# Altium schematic sheet FMC_ADC_128CH_10B.schdoc: FMC ADC 128CH 10B
size 420 x 297 mm; EDA_Number: ARTIQ; Projet: ARTIQ/SINARA; Author: G.Kasprowicz; CompanyName: WUT ISE; DrawnBy: G.Kasprowicz; Organization: WUT ISE; Address1: PW ISE; Address2: Nowowiejska 15/19 00-665 Warsaw; Address3: gkasprow@gmail.com; DocumentNumber: 6; Revision: 1.1; SheetNumber: 6; SheetTotal: 9; ModifiedBy: F. Świtakowski; CheckedDate: -; Title2: Top; DivGrp: WUT ISE; Designer: G.Kasprowicz; ModifiedDate: -; ProjectName: Sensor Box
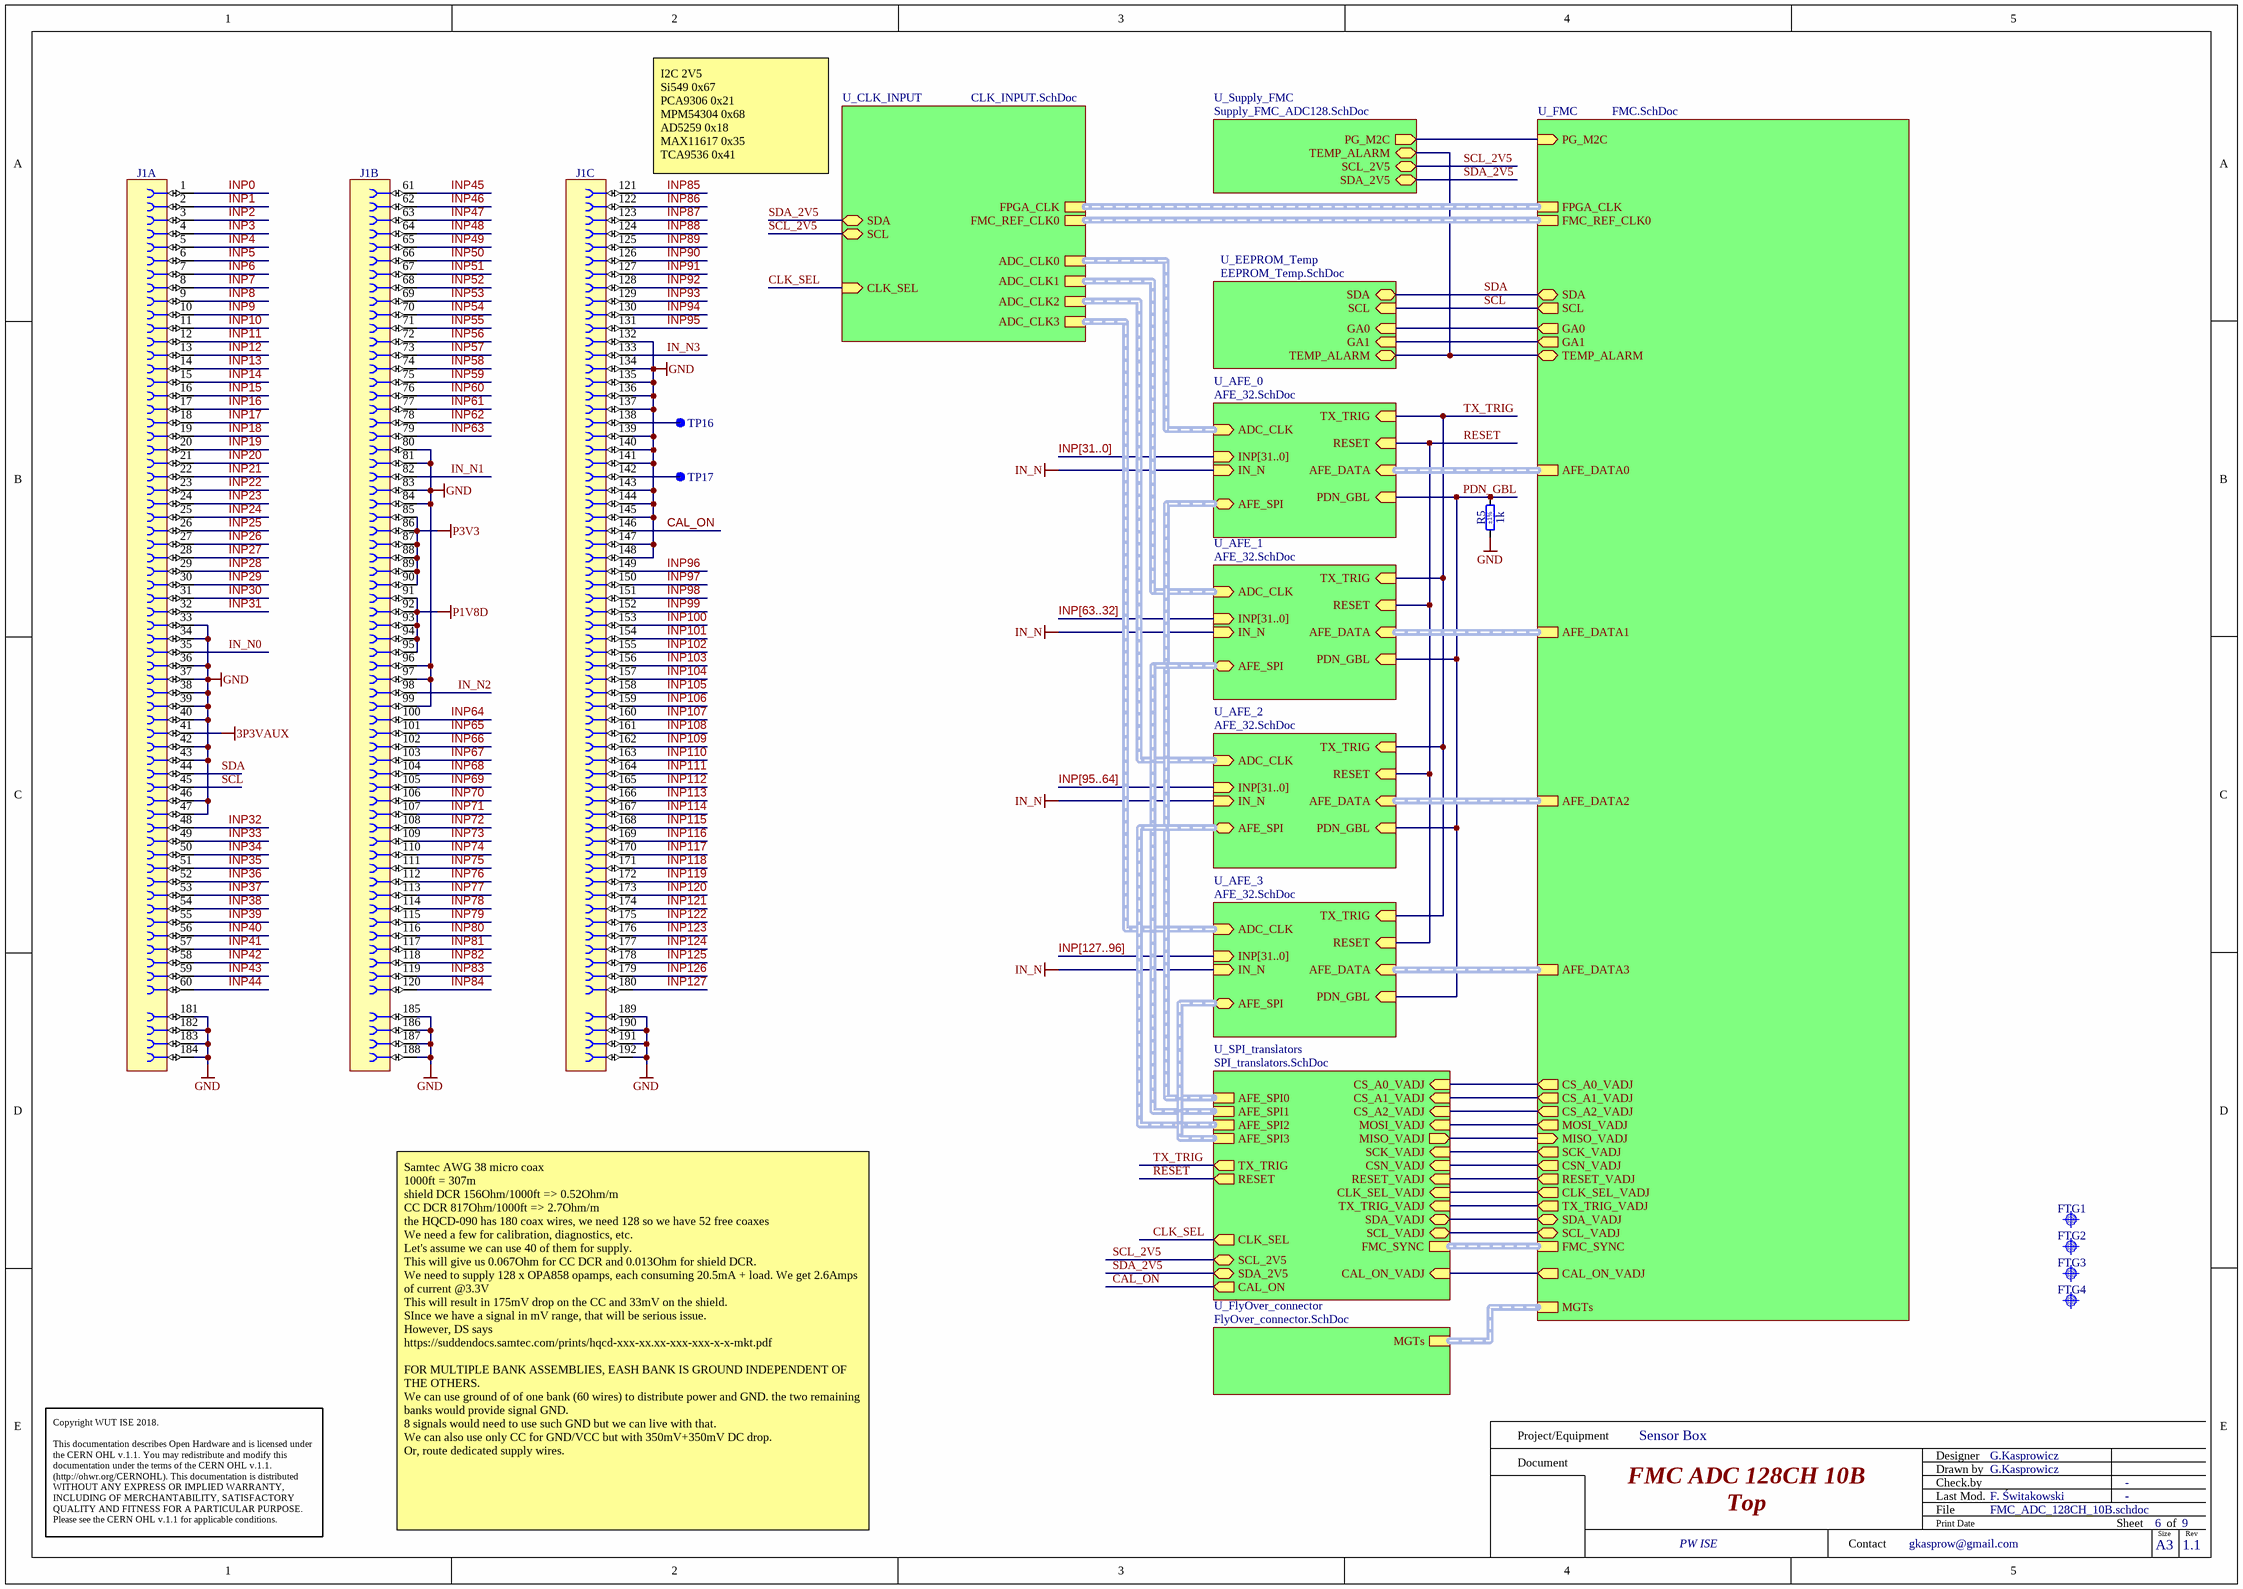
[diagram p0: FMC_ADC_128CH_10B.schdoc]

## Parts
FTG1  Use only in PCB  [FIDUCIAL_TOP_C100-200]  (value not drawn)  (no BOM)
FTG2  Use only in PCB  [FIDUCIAL_TOP_S100-200]  (value not drawn)  (no BOM)
FTG3  Use only in PCB  [FIDUCIAL_TOP_C100-200]  (value not drawn)  (no BOM)
FTG4  Use only in PCB  [FIDUCIAL_TOP_S100-200]  (value not drawn)  (no BOM)
J1  (no value)  [SAMTEC_QSH-090-01-L-D-A]  (parts A,B,C of 3)
R5  1k  Tolerance: ±1%  [RESC1005X40N]
TP16  SMD Pad  [C100]  (value not drawn)
TP17  SMD Pad  [C100]  (value not drawn)

## Sub-sheets
U_AFE_0 = AFE_32.SchDoc: PDN_GBL (in), ADC_CLK (in, harness DIFF), INP[31..0] (in), AFE_DATA (in, harness AFE_DATA), RESET (in), AFE_SPI (bidir, harness AFE_SPI), TX_TRIG (in), IN_N (in)
U_AFE_1 = AFE_32.SchDoc: PDN_GBL (in), ADC_CLK (in, harness DIFF), INP[31..0] (in), AFE_DATA (in, harness AFE_DATA), RESET (in), AFE_SPI (bidir, harness AFE_SPI), TX_TRIG (in), IN_N (in)
U_AFE_2 = AFE_32.SchDoc: PDN_GBL (in), ADC_CLK (in, harness DIFF), INP[31..0] (in), AFE_DATA (in, harness AFE_DATA), RESET (in), AFE_SPI (bidir, harness AFE_SPI), TX_TRIG (in), IN_N (in)
U_AFE_3 = AFE_32.SchDoc: PDN_GBL (in), ADC_CLK (in, harness DIFF), INP[31..0] (in), AFE_DATA (in, harness AFE_DATA), RESET (in), AFE_SPI (bidir, harness AFE_SPI), TX_TRIG (in), IN_N (in)
U_CLK_INPUT = CLK_INPUT.SchDoc: ADC_CLK0 (harness DIFFCLK), ADC_CLK1 (harness DIFFCLK), ADC_CLK2 (harness DIFFCLK), ADC_CLK3 (harness DIFFCLK), FMC_REF_CLK0 (harness DIFFCLK), FPGA_CLK (harness DIFFCLK), SCL (bidir), CLK_SEL (in), SDA (bidir)
U_EEPROM_Temp = EEPROM_Temp.SchDoc: SDA (bidir), SCL (in), GA0 (in), GA1 (in), TEMP_ALARM (bidir)
U_FlyOver_connector = FlyOver_connector.SchDoc: MGTs (harness MGTs)
U_FMC = FMC.SchDoc: GA0 (out), GA1 (out), SDA (bidir), SCL (out), TEMP_ALARM (bidir), FPGA_CLK (harness DIFF), PG_M2C (in), FMC_SYNC (harness DIFF), FMC_REF_CLK0 (harness DIFF), AFE_DATA0 (harness AFE_DATA), AFE_DATA1 (harness AFE_DATA), AFE_DATA2 (harness AFE_DATA), AFE_DATA3 (harness AFE_DATA), CS_A0_VADJ (out), CS_A1_VADJ (out), CS_A2_VADJ (out), MOSI_VADJ (out), MISO_VADJ (in), SCK_VADJ (out), RESET_VADJ (out), TX_TRIG_VADJ (out), SDA_VADJ (bidir), SCL_VADJ (bidir), CSN_VADJ (out), CLK_SEL_VADJ (out), CAL_ON_VADJ (out), MGTs (harness MGTs)
U_SPI_translators = SPI_translators.SchDoc: AFE_SPI0 (harness AFE_SPI), AFE_SPI1 (harness AFE_SPI), AFE_SPI2 (harness AFE_SPI), AFE_SPI3 (harness AFE_SPI), TX_TRIG (out), RESET (out), MOSI_VADJ (in), SCK_VADJ (in), RESET_VADJ (in), CS_A0_VADJ (in), CS_A1_VADJ (in), MISO_VADJ (out), CS_A2_VADJ (in), TX_TRIG_VADJ (in), CSN_VADJ (in), SCL_VADJ (bidir), SDA_VADJ (bidir), CLK_SEL (out), CLK_SEL_VADJ (in), FMC_SYNC (harness DIFF), CAL_ON_VADJ (in), SCL_2V5 (bidir), SDA_2V5 (bidir), CAL_ON (out)
U_Supply_FMC = Supply_FMC_ADC128.SchDoc: PG_M2C (out), TEMP_ALARM (bidir), SCL_2V5 (bidir), SDA_2V5 (bidir)

## Nets
3P3VAUX: J1.41
GND: J1.33 J1.34 J1.36 J1.37 J1.38 J1.39 J1.40 J1.42 J1.43 J1.46 J1.47 J1.80 J1.81 J1.83 J1.84 J1.96 J1.97 J1.99 J1.132 J1.134 J1.135 J1.136 J1.137 J1.139 J1.140 J1.141 J1.143 J1.144 J1.145 J1.147 J1.148 J1.181 J1.182 J1.183 J1.184 J1.185 J1.186 J1.187 J1.188 J1.189 J1.190 J1.191 J1.192 R5.1
IN_N: sheet U_AFE_0/IN_N, sheet U_AFE_1/IN_N, sheet U_AFE_2/IN_N, sheet U_AFE_3/IN_N
P1V8D: J1.91 J1.92 J1.93 J1.94 J1.95
P3V3: J1.85 J1.86 J1.87 J1.88 J1.89 J1.90
CAL_ON: J1.146 ; sheet U_SPI_translators/CAL_ON
CLK_SEL: sheet U_CLK_INPUT/CLK_SEL, sheet U_SPI_translators/CLK_SEL
IN_N0: J1.35
IN_N1: J1.82
IN_N2: J1.98
IN_N3: J1.133
INP0: J1.1
INP1: J1.2
INP2: J1.3
INP3: J1.4
INP4: J1.5
INP5: J1.6
INP6: J1.7
INP7: J1.8
INP8: J1.9
INP9: J1.10
INP10: J1.11
INP11: J1.12
INP12: J1.13
INP13: J1.14
INP14: J1.15
INP15: J1.16
INP16: J1.17
INP17: J1.18
INP18: J1.19
INP19: J1.20
INP20: J1.21
INP21: J1.22
INP22: J1.23
INP23: J1.24
INP24: J1.25
INP25: J1.26
INP26: J1.27
INP27: J1.28
INP28: J1.29
INP29: J1.30
INP30: J1.31
INP31: J1.32
INP32: J1.48
INP33: J1.49
INP34: J1.50
INP35: J1.51
INP36: J1.52
INP37: J1.53
INP38: J1.54
INP39: J1.55
INP40: J1.56
INP41: J1.57
INP42: J1.58
INP43: J1.59
INP44: J1.60
INP45: J1.61
INP46: J1.62
INP47: J1.63
INP48: J1.64
INP49: J1.65
INP50: J1.66
INP51: J1.67
INP52: J1.68
INP53: J1.69
INP54: J1.70
INP55: J1.71
INP56: J1.72
INP57: J1.73
INP58: J1.74
INP59: J1.75
INP60: J1.76
INP61: J1.77
INP62: J1.78
INP63: J1.79
INP64: J1.100
INP65: J1.101
INP66: J1.102
INP67: J1.103
INP68: J1.104
INP69: J1.105
INP70: J1.106
INP71: J1.107
INP72: J1.108
INP73: J1.109
INP74: J1.110
INP75: J1.111
INP76: J1.112
INP77: J1.113
INP78: J1.114
INP79: J1.115
INP80: J1.116
INP81: J1.117
INP82: J1.118
INP83: J1.119
INP84: J1.120
INP85: J1.121
INP86: J1.122
INP87: J1.123
INP88: J1.124
INP89: J1.125
INP90: J1.126
INP91: J1.127
INP92: J1.128
INP93: J1.129
INP94: J1.130
INP95: J1.131
INP96: J1.149
INP97: J1.150
INP98: J1.151
INP99: J1.152
INP100: J1.153
INP101: J1.154
INP102: J1.155
INP103: J1.156
INP104: J1.157
INP105: J1.158
INP106: J1.159
INP107: J1.160
INP108: J1.161
INP109: J1.162
INP110: J1.163
INP111: J1.164
INP112: J1.165
INP113: J1.166
INP114: J1.167
INP115: J1.168
INP116: J1.169
INP117: J1.170
INP118: J1.171
INP119: J1.172
INP120: J1.173
INP121: J1.174
INP122: J1.175
INP123: J1.176
INP124: J1.177
INP125: J1.178
INP126: J1.179
INP127: J1.180
PDN_GBL: R5.2 ; sheet U_AFE_0/PDN_GBL, sheet U_AFE_1/PDN_GBL, sheet U_AFE_2/PDN_GBL, sheet U_AFE_3/PDN_GBL
RESET: sheet U_AFE_0/RESET, sheet U_AFE_1/RESET, sheet U_AFE_2/RESET, sheet U_AFE_3/RESET, sheet U_SPI_translators/RESET
SCL: J1.45 ; sheet U_FMC/SCL, sheet U_EEPROM_Temp/SCL
SCL_2V5: sheet U_Supply_FMC/SCL_2V5, sheet U_CLK_INPUT/SCL, sheet U_SPI_translators/SCL_2V5
SDA: J1.44 ; sheet U_FMC/SDA, sheet U_EEPROM_Temp/SDA
SDA_2V5: sheet U_Supply_FMC/SDA_2V5, sheet U_CLK_INPUT/SDA, sheet U_SPI_translators/SDA_2V5
TX_TRIG: sheet U_AFE_0/TX_TRIG, sheet U_AFE_1/TX_TRIG, sheet U_AFE_2/TX_TRIG, sheet U_AFE_3/TX_TRIG, sheet U_SPI_translators/TX_TRIG
NetJ1_138: J1.138 TP16.1
NetJ1_142: J1.142 TP17.1
(unnamed): sheet U_Supply_FMC/PG_M2C, sheet U_FMC/PG_M2C
(unnamed): sheet U_Supply_FMC/TEMP_ALARM, sheet U_FMC/TEMP_ALARM, sheet U_EEPROM_Temp/TEMP_ALARM
(unnamed): sheet U_FMC/GA0, sheet U_EEPROM_Temp/GA0
(unnamed): sheet U_FMC/GA1, sheet U_EEPROM_Temp/GA1
(unnamed): sheet U_FMC/CS_A0_VADJ, sheet U_SPI_translators/CS_A0_VADJ
(unnamed): sheet U_FMC/CS_A1_VADJ, sheet U_SPI_translators/CS_A1_VADJ
(unnamed): sheet U_FMC/CS_A2_VADJ, sheet U_SPI_translators/CS_A2_VADJ
(unnamed): sheet U_FMC/MOSI_VADJ, sheet U_SPI_translators/MOSI_VADJ
(unnamed): sheet U_FMC/MISO_VADJ, sheet U_SPI_translators/MISO_VADJ
(unnamed): sheet U_FMC/SCK_VADJ, sheet U_SPI_translators/SCK_VADJ
(unnamed): sheet U_FMC/RESET_VADJ, sheet U_SPI_translators/RESET_VADJ
(unnamed): sheet U_FMC/TX_TRIG_VADJ, sheet U_SPI_translators/TX_TRIG_VADJ
(unnamed): sheet U_FMC/SDA_VADJ, sheet U_SPI_translators/SDA_VADJ
(unnamed): sheet U_FMC/SCL_VADJ, sheet U_SPI_translators/SCL_VADJ
(unnamed): sheet U_FMC/CSN_VADJ, sheet U_SPI_translators/CSN_VADJ
(unnamed): sheet U_FMC/CLK_SEL_VADJ, sheet U_SPI_translators/CLK_SEL_VADJ
(unnamed): sheet U_FMC/CAL_ON_VADJ, sheet U_SPI_translators/CAL_ON_VADJ

## Buses and harness runs
bus INP[31..0] = sheet U_AFE_0/INP[31..0]
bus INP[63..32] = sheet U_AFE_1/INP[31..0]
bus INP[95..64] = sheet U_AFE_2/INP[31..0]
bus INP[127..96] = sheet U_AFE_3/INP[31..0]
harness sheet U_AFE_0/ADC_CLK = sheet U_CLK_INPUT/ADC_CLK0
harness sheet U_AFE_0/AFE_DATA = sheet U_FMC/AFE_DATA0
harness sheet U_AFE_0/AFE_SPI = sheet U_SPI_translators/AFE_SPI0
harness sheet U_AFE_1/ADC_CLK = sheet U_CLK_INPUT/ADC_CLK1
harness sheet U_AFE_1/AFE_DATA = sheet U_FMC/AFE_DATA1
harness sheet U_AFE_1/AFE_SPI = sheet U_SPI_translators/AFE_SPI1
harness sheet U_AFE_2/ADC_CLK = sheet U_CLK_INPUT/ADC_CLK2
harness sheet U_AFE_2/AFE_DATA = sheet U_FMC/AFE_DATA2
harness sheet U_AFE_2/AFE_SPI = sheet U_SPI_translators/AFE_SPI2
harness sheet U_AFE_3/ADC_CLK = sheet U_CLK_INPUT/ADC_CLK3
harness sheet U_AFE_3/AFE_DATA = sheet U_FMC/AFE_DATA3
harness sheet U_AFE_3/AFE_SPI = sheet U_SPI_translators/AFE_SPI3
harness sheet U_CLK_INPUT/FMC_REF_CLK0 = sheet U_FMC/FMC_REF_CLK0
harness sheet U_CLK_INPUT/FPGA_CLK = sheet U_FMC/FPGA_CLK
harness sheet U_FlyOver_connector/MGTs = sheet U_FMC/MGTs
harness sheet U_FMC/FMC_SYNC = sheet U_SPI_translators/FMC_SYNC

## Notes on the sheet
- (near J1) I2C 2V5
  Si549 0x67
  PCA9306 0x21
  MPM54304 0x68
  AD5259 0x18
  MAX11617 0x35
  TCA9536 0x41
- Samtec AWG 38 micro coax
  1000ft = 307m
  shield DCR 156Ohm/1000ft => 0.52Ohm/m
  CC DCR 817Ohm/1000ft => 2.7Ohm/m
  the HQCD-090 has 180 coax wires, we need 128 so we have 52 free coaxes
  We need a few for calibration, diagnostics, etc.
  Let's assume we can use 40 of them for supply.
  This will give us 0.067Ohm for CC DCR and 0.013Ohm for shield DCR.
  We need to supply 128 x OPA858 opamps, each consuming 20.5mA + load. We get 2.6Amps of current @3.3V
  This will result in 175mV drop on the CC and 33mV on the shield.
  SInce we have a signal in mV range, that will be serious issue.
  However, DS says
  https://suddendocs.samtec.com/prints/hqcd-xxx-xx.xx-xxx-xxx-x-x-mkt.pdf
  FOR MULTIPLE BANK ASSEMBLIES, EASH BANK IS GROUND INDEPENDENT OF THE OTHERS.
  We can use ground of of one bank (60 wires) to distribute power and GND. the two remaining banks would provide signal GND.
  8 signals would need to use such GND but we can live with that.
  We can also use only CC for GND/VCC but with 350mV+350mV DC drop.
  Or, route dedicated supply wires.
- Project/Equipment
- Document
- Designer
- Drawn by
- Check.by
- Copyright WUT ISE 2018.
  This documentation describes Open Hardware and is licensed under the CERN OHL v.1.1. You may redistribute and modify this documentation under the terms of the CERN OHL v.1.1. (http://ohwr.org/CERNOHL). This documentation is distributed WITHOUT ANY EXPRESS OR IMPLIED WARRANTY, INCLUDING OF MERCHANTABILITY, SATISFACTORY QUALITY AND FITNESS FOR A PARTICULAR PURPOSE. Please see the CERN OHL v.1.1 for applicable conditions.
- Contact
- File
- Last Mod.
- Print Date
- Sheet
- Size
- A3
- of
- Rev

## Library data of the parts
FTG1 FTG3 = FIDUCIAL_TARGET_C100-200: Fiducial Target; Part Description: Round Fiducial Target, Top Layer, 1.0mm, Top Solder 2.0mm, Keepout =2.0mm; Mounted: No; Part Number: FIDUCIAL_TARGET_C100-200; Component Type: Standard (No BOM); Pin Count: 1; Family: Fiducial; Socket: No; SMD: Yes; Sense: No; Status: None; ComponentHeight: 0mm; HelpURL: Undefined; Author: CERN DEM JLC; CreateDate: 09.02.2010; LatestRevisionDate: 04.04.2012; PackageDescription: Round Fiducial Target, Top Layer, 1.0mm, Top Solder 2.0mm, Keepout =2.0mm
FTG2 FTG4 = FIDUCIAL_TARGET_S100-200: Fiducial Target; Part Description: Square Fiducial Target, Top Layer, 1.0mm, Top Solder 2.0mm, Keepout =2.0mm; Mounted: No; Part Number: FIDUCIAL_TARGET_S100-200; Component Type: Standard (No BOM); Pin Count: 1; Family: Fiducial; Socket: No; SMD: Yes; Sense: No; Status: None; ComponentHeight: 0mm; HelpURL: Undefined; Author: CERN DEM JLC; CreateDate: 09.02.2010; LatestRevisionDate: 04.04.2012; PackageDescription: Square Fiducial Target, Top Layer, 1.0mm, Top Solder 2.0mm, Keepout =2.0mm
J1 = SAMTEC_QSH-090-01-L-D-A: Connector 180 Female (3x60) + 3x4 GND; Part Description: 180 Contacts ((2X30)x3), Pitch 0.5mm, Straight Double Row High Speed Ground Plane Socket; Manufacturer: SAMTEC; PressFit: No; Part Number: SAMTEC_QSH-090-01-L-D-A; Component Kind: Standard; Component Type: Standard; Pin Count: 192; Mounted: Yes; Socket: No; SMD: Yes; Sense: No; Status: None; Manufacturer Part Number: QSH-090-01-L-D-A; ComponentHeight: 3.25mm; HelpURL: \\cern.ch\dfs\Applications\Altium\Datasheets\SAMTEC_QSH-090-01-L-D-A.pdf; Author: CERN DEM MR; CreateDate: 08.09.2017; LatestRevisionDate: 08.09.2017
R5 = R0402_1K_1%_0.0625W_100PPM: Resistor - 1%; Part Description: General Purpose Thick Film Chip Resistor; Manufacturer: GENERIC; Manufacturer1 Part Number: 232270671002L; TC: ±100ppm/°C; PressFit: No; Part Number: R0402_1K_1%_0.0625W_100PPM; Component Kind: Standard; Component Type: Standard; Pin Count: 2; Value: 1k; Status: Not Recommended; Power: 0.0625W; Manufacturer Part Number: R0402_1K_1%_0.0625W_100PPM; Case: 0402; Mounted: Yes; Sense: No; Socket: No; SMD: Yes; Manufacturer1 Example: YAGEO PHYCOMP; Manufacturer1 ComponentHeight: 0.4mm; HelpURL: \\cern.ch\dfs\Applications\Altium\Datasheets\R0402_Phycomp_RC0402.pdf; Author: CERN DEM JLC; CreateDate: 03.12.2007; LatestRevisionDate: 17.10.2012
TP16 TP17 = SMD_PAD_D1MM: Pad; Part Description: 1mm Diameter SMD Pad; Mounted: No; Part Number: SMD_PAD_D1MM; Component Kind: Standard (No BOM); Component Type: Standard (No BOM); Pin Count: 1; Family: SMD Pad; Socket: No; SMD: Yes; Sense: No; Status: None; ComponentHeight: 0mm; HelpURL: Undefined; Author: CERN DEM JLC; CreateDate: 10.10.2017; LatestRevisionDate: 10.10.2017; PackageDescription: 1mm Diameter SMD Pad